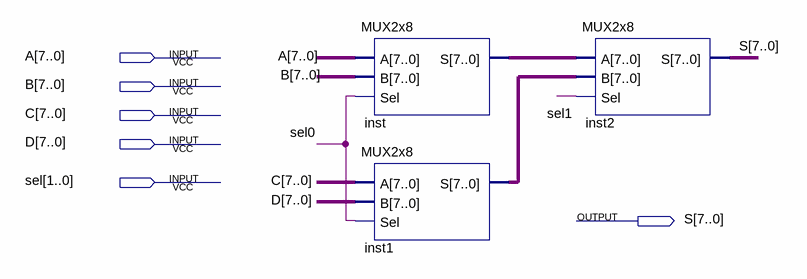
[diagram p0: schematic sheet]
// Quartus schematic MUX4x8.bdf as structural Verilog: 3 symbols, 6 pins
module MUX4x8 (
  input  [7:0] A,
  input  [7:0] B,
  input  [7:0] C,
  input  [7:0] D,
  input  [1:0] sel,
  output [7:0] S
);

  wire [7:0] inst1_s, inst_s;

  MUX2x8 inst (.A(A), .B(B), .Sel(sel[0]), .S(inst_s));
  MUX2x8 inst1 (.A(C), .B(D), .Sel(sel[0]), .S(inst1_s));
  MUX2x8 inst2 (.A(inst_s), .B(inst1_s), .Sel(sel[1]), .S(S));
endmodule
